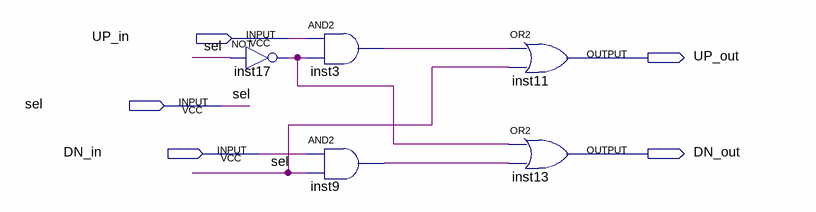
[diagram p0: schematic sheet]
// Quartus schematic counter_ctrl.bdf as structural Verilog: 5 symbols, 5 pins
module counter_ctrl (
  input  UP_in,
  input  sel,
  input  DN_in,
  output UP_out,
  output DN_out
);

  wire inst3_out, inst9_out, inst17_out;

  not inst17 (inst17_out, sel);
  and inst3 (inst3_out, UP_in, inst17_out);
  and inst9 (inst9_out, DN_in, sel);
  or inst11 (UP_out, inst3_out, sel);
  or inst13 (DN_out, inst17_out, inst9_out);
endmodule
